# Altium schematic sheet Programming.SchDoc
size A4; DocumentNumber: 3; SheetNumber: 3; SheetTotal: 11
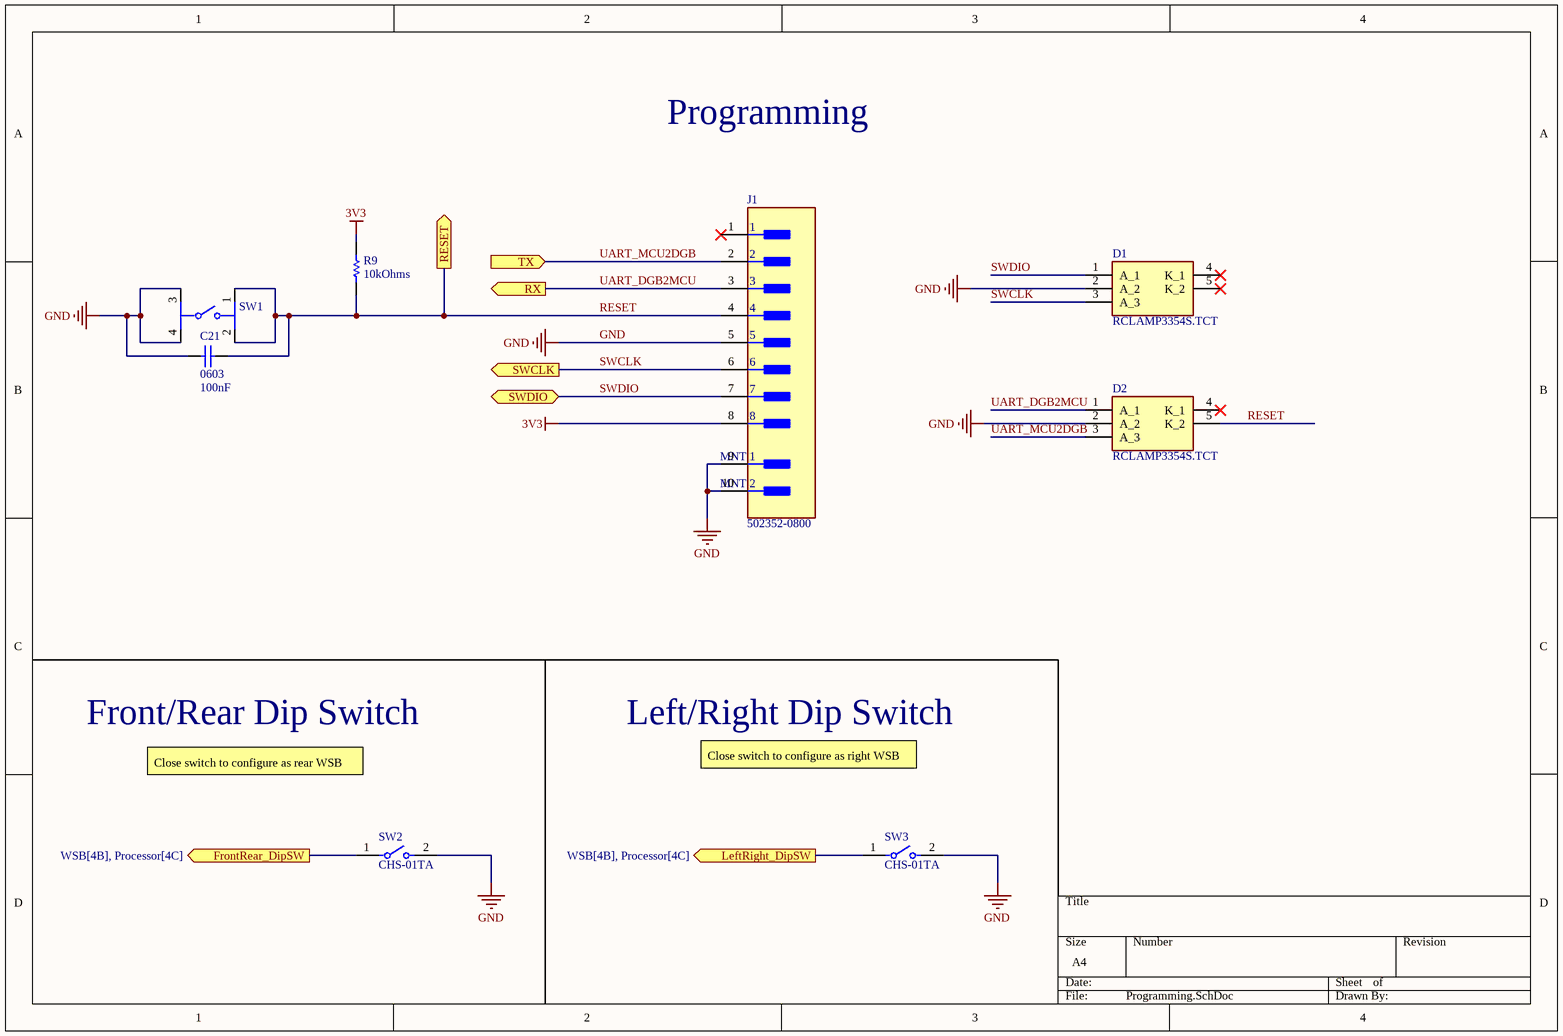
[diagram p0: Programming.SchDoc]

## Parts
C21  Case Code (Imperial): 0603  Capacitance: 100nF  [CAPC1608X87X35NL15T15]  (hidden comment: C0603X104K5RACTU)
D1  RCLAMP3354S.TCT  [SOT95P280X145-5N]
D2  RCLAMP3354S.TCT  [SOT95P280X145-5N]
J1  502352-0800  [FP-502352-0800-MFG]
R9  Resistance: 10kOhms  [RESC1608X55X25ML10T15]  (hidden comment: RC0603JR-0710KL)
SW1  PTS645SM43SMTR92LFS  [FP-PTS645SM43SMTR92LFS-MFG]  (value not drawn)
SW2  CHS-01TA  [FP-CHS-01TA-MFG]
SW3  CHS-01TA  [FP-CHS-01TA-MFG]

## Ports
FrontRear_DipSW (out, see WSB[4B], Processor[4C]), LeftRight_DipSW (out, see WSB[4B], Processor[4C]), RESET (out, see WSB[4B], Processor[3B]), RX (out, see WSB[4B]), SWCLK (out, see WSB[4B], Processor[2B]), SWDIO (bidir, see WSB[4B], Processor[2B]), TX (in, see WSB[4B])

## Nets
3V3: J1.8 R9.2
GND: C21.2 D1.2(A_2) D2.2(A_2) J1.5 J1.9(MNT_1) J1.10(MNT_2) SW1.3 SW1.4 SW2.2 SW3.2
FrontRear_DipSW: SW2.1 ; port FrontRear_DipSW
LeftRight_DipSW: SW3.1 ; port LeftRight_DipSW
RESET: C21.1 D2.5(K_2) J1.4 R9.1 SW1.1 SW1.2 ; port RESET
SWCLK: D1.3(A_3) J1.6 ; port SWCLK
SWDIO: D1.1(A_1) J1.7 ; port SWDIO
UART_DGB2MCU: D2.1(A_1) J1.3 ; port RX
UART_MCU2DGB: D2.3(A_3) J1.2 ; port TX

Not connected (* = marked no-connect by the designer): D1 4(K_1)* 5(K_2)*; D2 4(K_1)*; J1 1*

## Notes on the sheet
- Programming
- Front/Rear Dip Switch
- Close switch to configure as rear WSB
- Left/Right Dip Switch
- Close switch to configure as right WSB

## Library data of the parts
C21 = CMP-2006-03300-1: Manufacturer: Kemet; Dielectric Material: Ceramic; Tolerance: 10%; Voltage Rating: 50V; Dielectric: X7R; Dissipation Factor: 2.5%; Part Number: C0603X104K5RACTU; Supplier 1: Digi-Key; Supplier Part Number 1: 399-7969-1-ND; Manufacturer Part Number: C0603X104K5RACTU; Stock 1: 2206541; Pricing 1: 1 = 0.21000, 10 = 0.14500, 100 = 0.07340, 500 = 0.05024, 1000 = 0.04444 (USD); RoHS: Yes; Mount: Surface Mount; Case/Package: 0603; Number of Pins: 2; Case Code (Metric): 1608; Min Operating Temperature: -55°C; Max Operating Temperature: 125°C; Packaging: Tape and Reel; Package Quantity: 1; Voltage Rating (DC): 50V; Termination: SMD/SMT; Voltage: 50V; Features: Soft Termination; Length: 1.6mm; Height: 0.8mm; Width: 0.8mm; Depth: 0.8mm; Thickness: 0.034inch; Radiation Hardening: No; REACH SVHC: No SVHC; ComponentLink1URL: https://datasheet.ciiva.com/7823/1776088-7823908.pdf?src-supplier=Element14; ComponentLink1Description: https://datasheet.ciiva.com/7823/1776088-7823908.pdf?src-supplier=Element14; ComponentLink2URL: https://datasheet.ciiva.com/26948/getdatasheetpartid-385607-26948458.pdf?src-supplier=Verical; ComponentLink2Description: https://datasheet.ciiva.com/26948/getdatasheetpartid-385607-26948458.pdf?src-supplier=Verical; ComponentLink3URL: https://datasheet.ciiva.com/7823/1776088-7823909.pdf?src-supplier=Element14; ComponentLink3Description: https://datasheet.ciiva.com/7823/1776088-7823909.pdf?src-supplier=Element14; ComponentLink4URL: https://datasheet.ciiva.com/6279/kem-c1013-x7r-ft-cap-smd-6279993.pdf?src-supplier=Digi-Key; ComponentLink4Description: https://datasheet.ciiva.com/6279/kem-c1013-x7r-ft-cap-smd-6279993.pdf?src-supplier=Digi-Key; ComponentLink5URL: https://datasheet.ciiva.com/28533/1918693-28533212.pdf?src-supplier=Element14; ComponentLink5Description: https://datasheet.ciiva.com/28533/1918693-28533212.pdf?src-supplier=Element14; ComponentLink6URL: https://datasheet.ciiva.com/6279/kem-c1013-x7r-ft-cap-smd-6279999.pdf?src-supplier=Digi-Key; ComponentLink6Description: https://datasheet.ciiva.com/6279/kem-c1013-x7r-ft-cap-smd-6279999.pdf?src-supplier=Digi-Key; ComponentLink7URL: https://datasheet.ciiva.com/6279/kem-c1013-x7r-ft-cap-smd-6279990.pdf?src-supplier=Digi-Key; ComponentLink7Description: https://datasheet.ciiva.com/6279/kem-c1013-x7r-ft-cap-smd-6279990.pdf?src-supplier=Digi-Key; ComponentLink8URL: https://datasheet.ciiva.com/14597/70096394-14597743.pdf?src-supplier=Allied+Electronics; ComponentLink8Description: https://datasheet.ciiva.com/14597/70096394-14597743.pdf?src-supplier=Allied+Electronics
D1 D2 = RCLAMP3354S.TCT: TVS Diode (Bi-directional); Manufacturer_Name: SEMTECH; Datasheet Link: https://semtech.my.salesforce.com/sfc/p/#E0000000JelG/a/44000000MCrm/q3IJaquvh9BkANCL4E8HYT8vxS.k3jwPHRhsWr6XNsI; Height: 1.45mm; Manufacturer_Part_Number: RCLAMP3354S.TCT; Mouser Part Number: 947-RCLAMP3354S.TCT; Mouser Price/Stock: https://www.mouser.co.uk/ProductDetail/Semtech/RCLAMP3354S.TCT?qs=rBWM4%252BvDhIcjyMg1J9MbMw%3D%3D; Arrow Part Number: RCLAMP3354S.TCT; Arrow Price/Stock: https://www.arrow.com/en/products/rclamp3354s.tct/semtech?region=europe
  D1: Supplier 1: Arrow Electronics; Supplier Part Number 1: RCLAMP3354S.TCT
J1 = CMP-04776-000280-1: CONN HEADER SMD R/A 8POS 2MM; Max Current Rating: 3A; Primary Type: Rectangular; Number of Contacts: 8; Gender: Male; Connector Type: Male Pin; Glow Wire Compliant: Non-compliant; Voltage Rating: 125V; Orientation: Right Angle; Contact Plating: Tin; Series: DuraClik™ 502352; Color: Natural; Mount: Surface Mount; Contact Gender: Male; Length: 20mm; Radiation Hardening: No; Max Operating Temperature: 105°C; Package Quantity: 2800; Housing Material: Polyamide; Depth: 9.4mm; Current Rating: 3A; Pitch: 2mm; Housing Color: Natural; Contact Type: Male Pin; Number of Circuits: 8; Contact Material: Copper Alloy; Fastening Type: Latch; Number of Positions: 8; Packaging: Tape and Reel; Termination: Solder; Number of Rows: 1; Min Operating Temperature: -40°C
R9 = CMP-2000-05022-1: Resistor, 10 KOhm, +/- 5%, 100 mW, -55 to 155 degC, 0603 (1608 Metric), RoHS, Tape and Reel; Manufacturer: Yageo; Voltage Rating: 50V; Temperature Coefficient: 100PPM/C; Power Rating: 100mW; Package Reference: 603; Series: RC; Case Code - mm: 1608; Packaging: Reel; Datasheet URL: http://www.farnell.com/datasheets/443971.pdf; Datasheet Version: Rev. 4, 04/2009; Operating Temperature Range: -55Cto+155C; Product: ThickFilmResistorsGeneralPurpose; Package Description: 2-Pin Surface Mount Device, Body 1.6 x 0.8 mm; Manufacturer URL: http://www.yageo.com/; Case Code - in: 0603; Tolerance: 5%; Termination Style: SMD/SMT
SW1 = CMP-2000-05160-2: SWITCH TACTILE SPST-NO 0.05A 12V; Contact Resistance: 100mR; Throw Configuration: SPST; Illumination Type: Non-Illuminated; Mechanical Life: 100000Cycles; Current Rating: 50mA; Switch Function: Off-Mom; Actuator Length: 0.85mm; Actuator Material: Nylon; Actuator Type: Standard; Operating Force: 160gf; Min Operating Temperature: -20°C; REACH SVHC: No SVHC; Termination: Gull Wing; Case/Package: SMD/SMT; Packaging: Tape and Reel; Mount: Surface Mount; Voltage Rating (DC): 12V; Orientation: Straight; Lead Free: Lead Free; Contact Material: Silver; Color: Black; Max Current Rating: 50mA; Contact Plating: Silver; Depth: 9mm; Package Quantity: 1; Max Voltage Rating (DC): 12V; Length: 6mm; Max Operating Temperature: 60°C
SW2 SW3 = CMP-71740-000003-1: SWITCH SLIDE DIP SPST 100MA 6V; Manufacturer: Nidec Copal Electronics; Contact Resistance: 50mΩ; Standoff Height: 0mm; Number Of Circuits: 1; Electromechanical Life: 2000Cycles; Device Class L1: Electromechanical; Device Class L2: Switches; Category: Switch; Temperature Range Low: -40°C; Device Class L3: DIP Switches; Height: 2.5mm; Lead Free: Yes; Octopart: https://octopart.com/chs-01ta-nidec+copal-52304644; Throw Configuration: SPST; Package: CHS-01TA; Voltage Rating Dc: 6V; Digikey Description: SWITCH SLIDE DIP SPST 100MA 6V; Mount: Surface Mount; Automotive: No; Contact Current Rating: 100mA; ComponentLink2URL: https://www.nidec-copal-electronics.com/e/catalog/switch/chs.pdf; ComponentLink2Description: Datasheet; Temperature: -40°C to +85°C; Temperature Range High: +85°C; RoHS: TRUE; Manufacturer Part Number: CHS-01TA